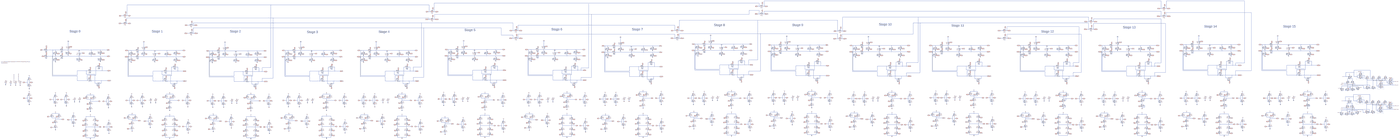
[diagram p0: schematic 16_bit carry_skip_adder.asc, whole sheet]
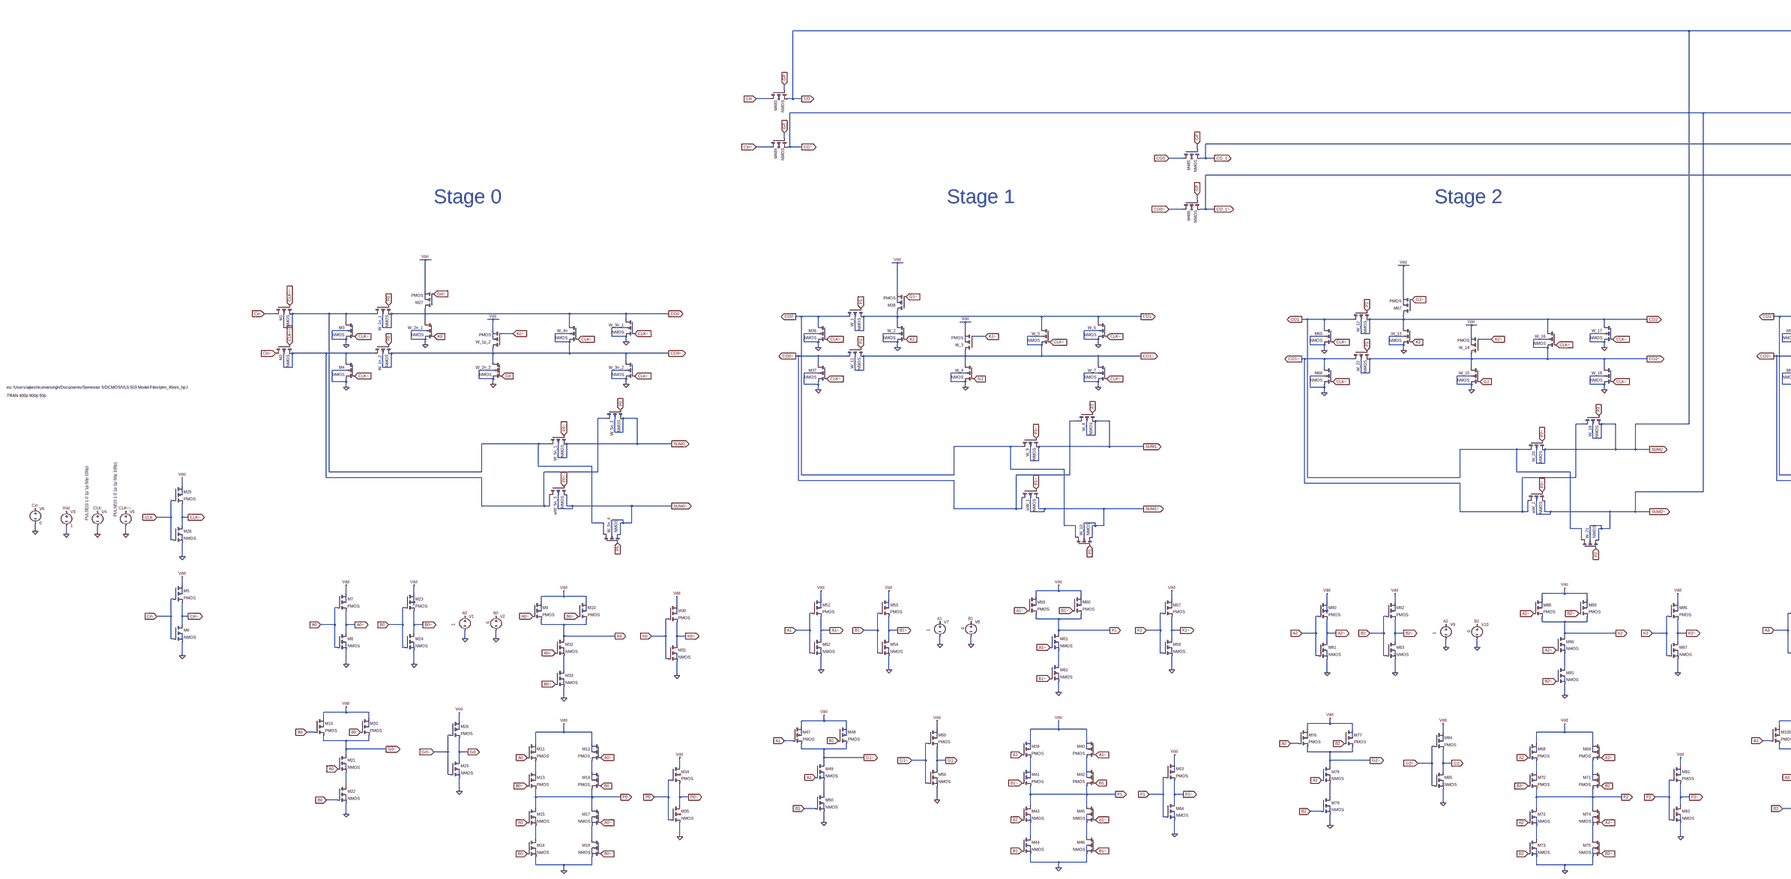
[diagram p1: schematic 16_bit carry_skip_adder.asc, part, row 1 of 1, column 1 of 5]
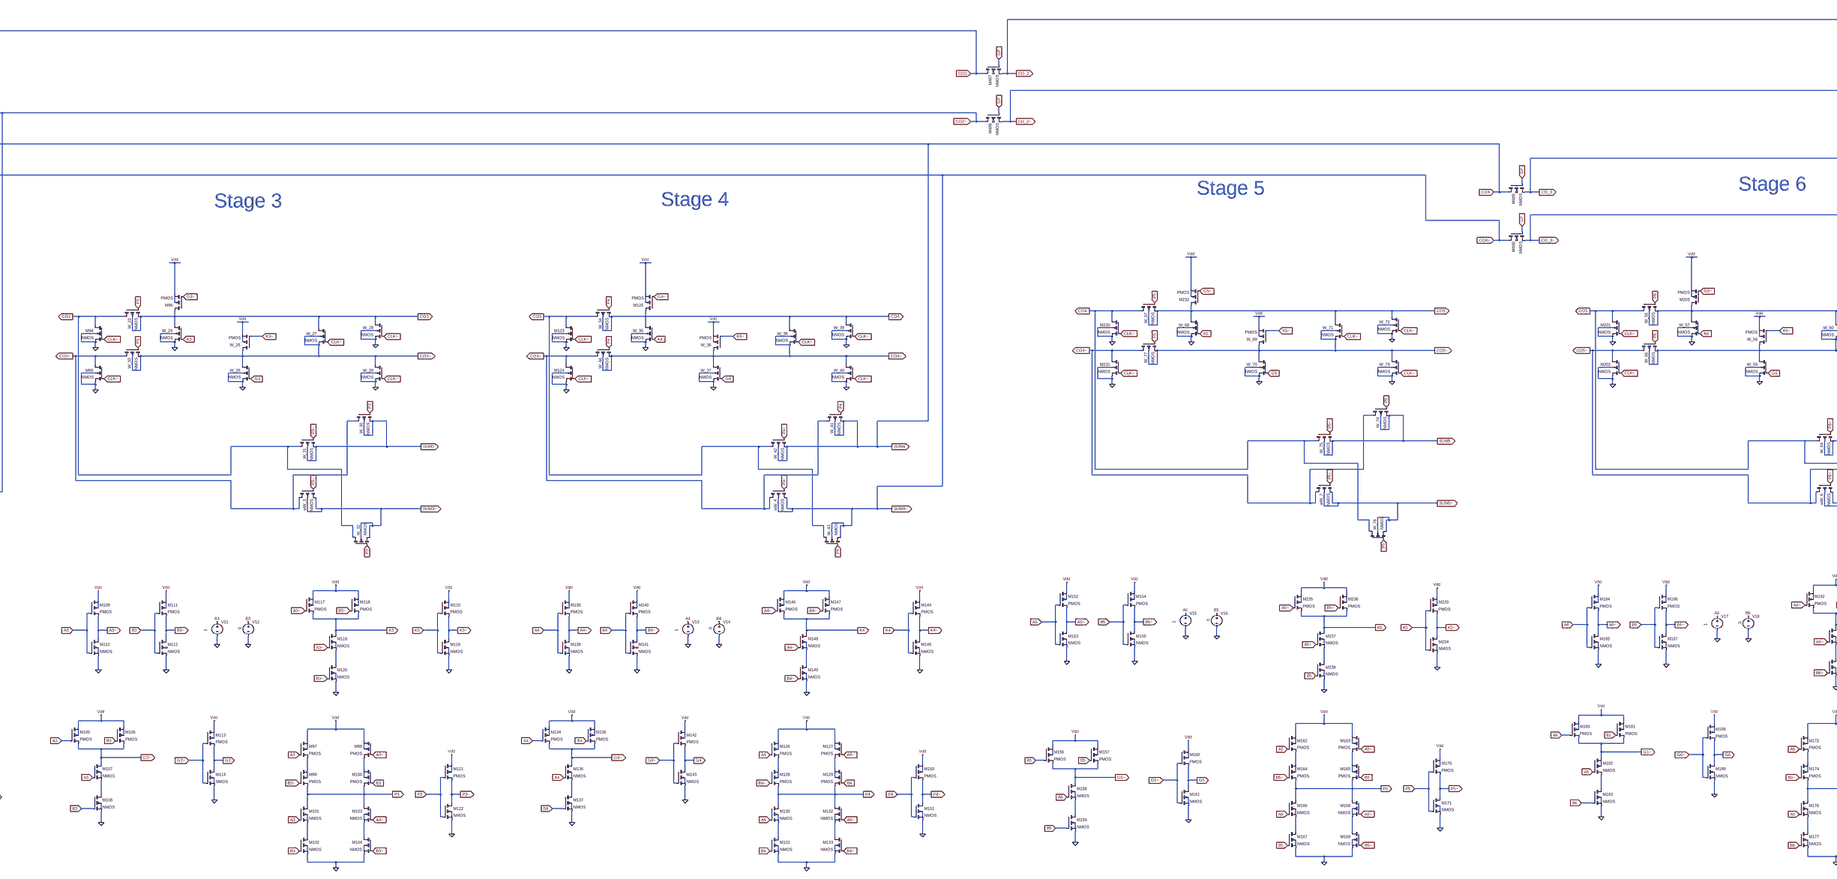
[diagram p2: schematic 16_bit carry_skip_adder.asc, part, row 1 of 1, column 2 of 5]
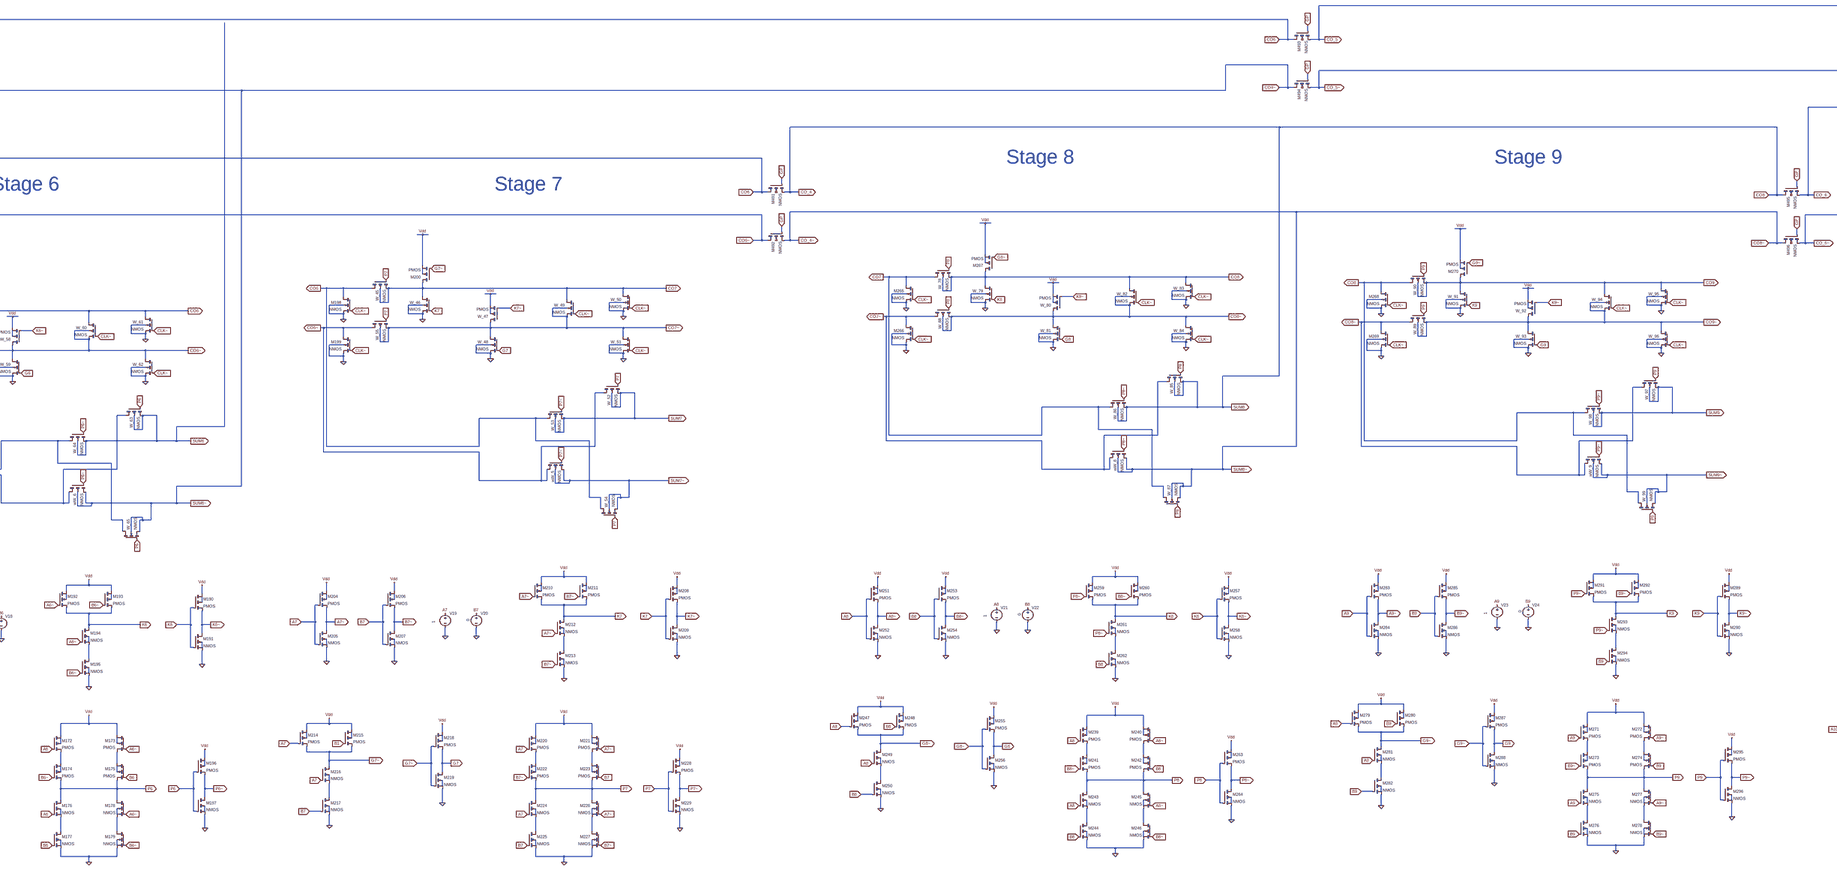
[diagram p3: schematic 16_bit carry_skip_adder.asc, part, row 1 of 1, column 3 of 5]
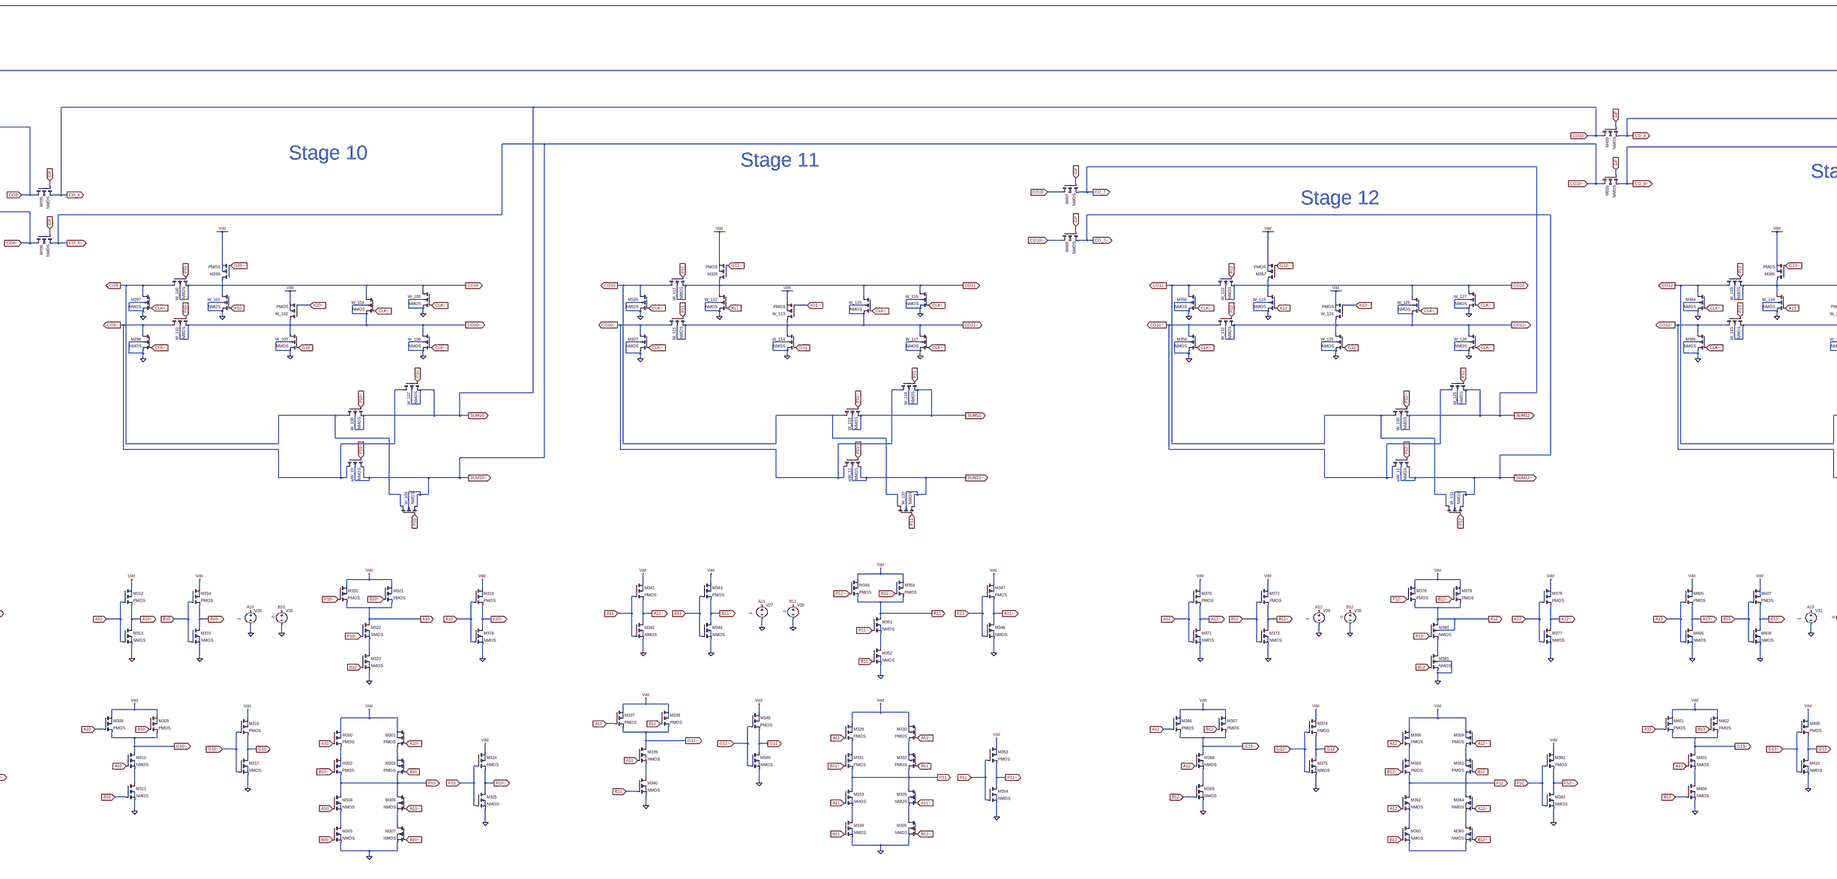
[diagram p4: schematic 16_bit carry_skip_adder.asc, part, row 1 of 1, column 4 of 5]
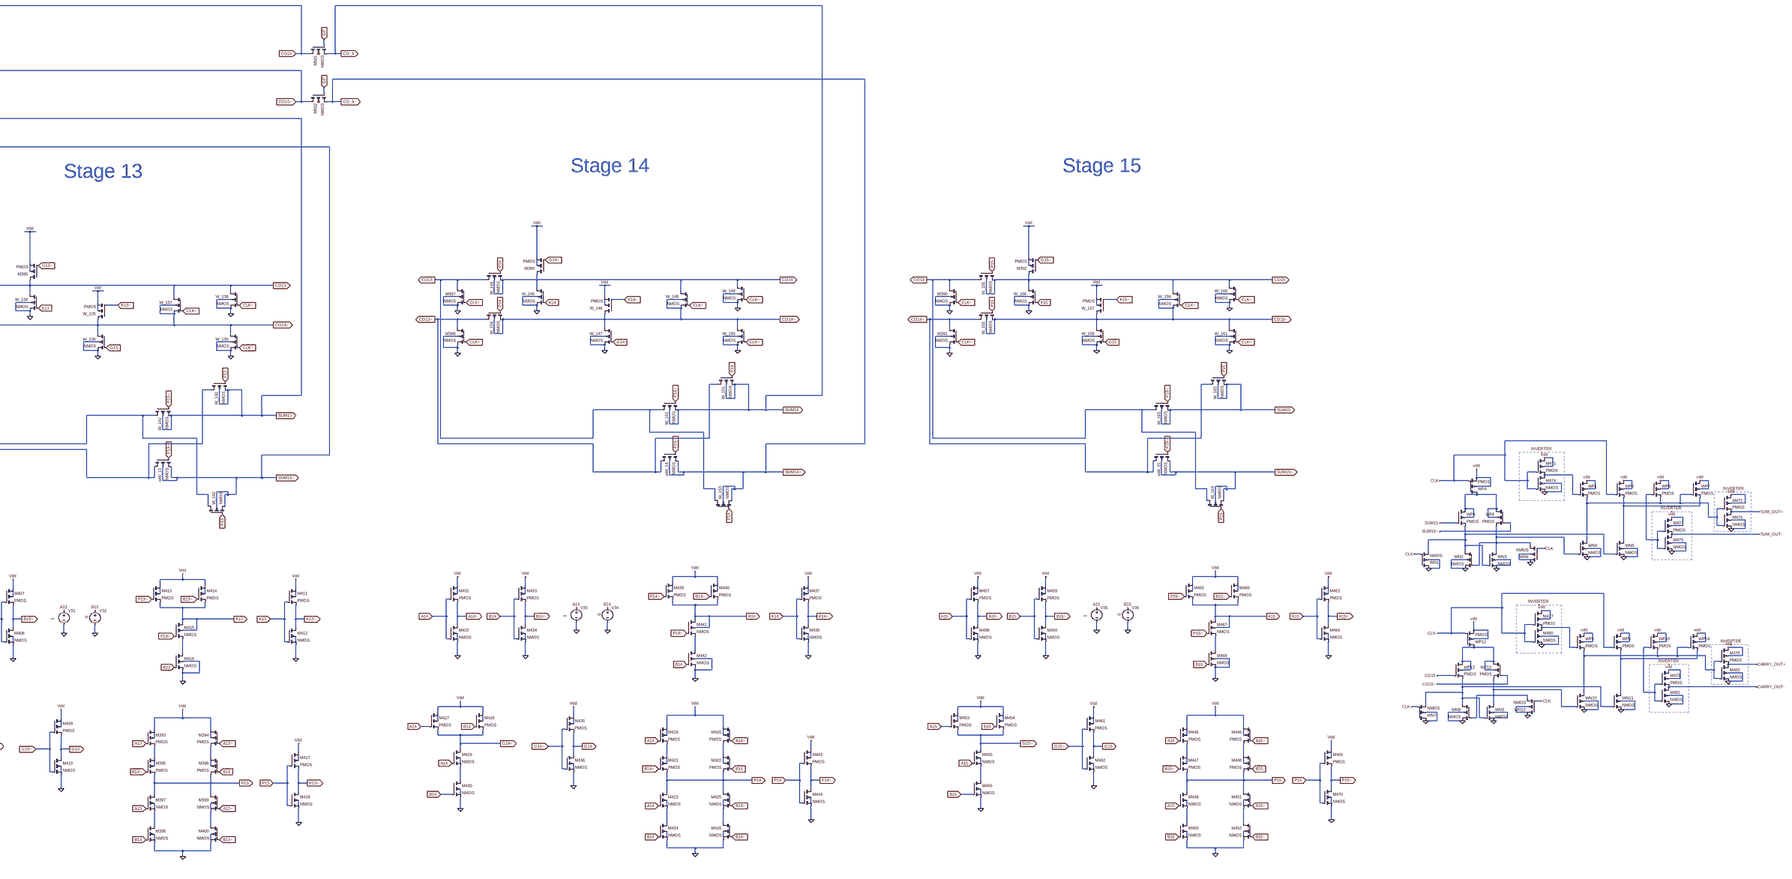
[diagram p5: schematic 16_bit carry_skip_adder.asc, part, row 1 of 1, column 5 of 5]
* 16_bit carry_skip_adder.asc
M§W_1n_1 N025 P0 CO0 CO0 NMOS l=45nm w=90nm
M§W_2n_1 CO0 K0 0 0 NMOS l=45nm w=180nm
M§W_1p_2 CO0~ K0~ Vdd N029 PMOS l=45nm w=180nm
M§W_2n_2 CO0~ G0 0 0 NMOS l=45nm w=180n
M§W_4n CO0 CLK~ CO0~ CO0~ NMOS l=45nm w=360nm
M§W_3n_1 CO0 CLK~ 0 0 NMOS l=45nm w=270nm
M§W_3n_2 CO0~ CLK~ 0 0 NMOS l=45nm w=270nm
M§W_5n_2 N034 P0 SUM0 SUM0 NMOS l=45nm w=450nm
M§W_5n_1 N025 P0~ SUM0 SUM0 NMOS l=45nm w=450nm
M§wW_5n_3 N034 P0~ SUM0~ SUM0~ NMOS l=45nm w=450nm
M§W_5n_4 N025 P0 SUM0~ SUM0~ NMOS l=45nm w=450nm
M3 N025 CLK~ 0 0 NMOS l=45nm w=90nm
M4 N034 CLK~ 0 0 NMOS l=45nm w=90nm
M2 Cin~ CLK~~ N034 N034 NMOS l=45nm w=90nm
M1 Cin CLK~~ N025 N025 NMOS l=45nm w=90nm
V1 A0 0 1
V2 B0 0 0
V3 Vdd 0 1
M11 Vdd A0 N369 N292 PMOS l=45n w=180n
M12 Vdd A0~ N370 N293 PMOS l=45n w=180n
M13 N369 B0~ P0 N399 PMOS l=45n w=180n
M14 N370 B0 P0 N400 PMOS l=45n w=180n
M15 P0 A0 N527 N488 NMOS l=45n w=90n
M16 N527 B0 0 N550 NMOS l=45n w=90n
M17 P0 A0~ N528 N489 NMOS l=45n w=90n
M18 N528 B0~ 0 N551 NMOS l=45n w=90n
M19 Vdd A0 G0~ N240 PMOS l=45nm w=90nm
M20 Vdd B0 G0~ N241 PMOS l=45nm w=90nm
M21 G0~ A0 N414 N359 NMOS l=45nm w=90nm
M22 N414 B0 0 N432 NMOS l=45nm w=90nm
M§W_1n_2 N034 P0 CO0~ CO0~ NMOS l=45nm w=90nm
V4 CLK 0 PULSE(0 1 0 1p 1p 50p 100p)
M25 Vdd CLK CLK~ N036 PMOS l=45nm w=180nm
M26 CLK~ CLK 0 N043 NMOS l=45nm w=90nm
V5 CLK~~ 0 PULSE(0 1 0 1p 1p 50p 100p)
V6 Cin 0 0
M5 Vdd Cin Cin~ N062 PMOS l=45nm w=180nm
M6 Cin~ Cin 0 N137 NMOS l=45nm w=90nm
M7 Vdd A0 A0~ N094 PMOS l=45nm w=180n
M8 A0~ A0 0 N163 NMOS l=45n w=90n
M23 Vdd B0 B0~ N095 PMOS l=45nm w=180n
M24 B0~ B0 0 N164 NMOS l=45n w=90n
M27 CO0 G0~ Vdd N012 PMOS l=45nm w=180nm
M28 Vdd G0~ G0 N245 PMOS l=45nm w=180n
M29 G0 G0~ 0 N385 NMOS l=45n w=90n
M30 Vdd K0 K0~ N124 PMOS l=45nm w=180n
M31 K0~ K0 0 N196 NMOS l=45n w=90n
M9 Vdd A0~ K0 N119 PMOS l=45nm w=90nm
M10 Vdd B0~ K0 N120 PMOS l=45nm w=90nm
M32 K0 A0~ N209 N182 NMOS l=45nm w=90nm
M33 N209 B0~ 0 N216 NMOS l=45nm w=90nm
M34 Vdd P0 P0~ NC_01 PMOS l=45nm w=180n
M35 P0~ P0 0 NC_02 NMOS l=45n w=90n
M§W_1 CO0 P1 CO1 CO1 NMOS l=45nm w=90nm
M§W_2 CO1 K1 0 0 NMOS l=45nm w=180nm
M§W_3 CO1~ K1~ Vdd N030 PMOS l=45nm w=180nm
M§W_4 CO1~ G1 0 0 NMOS l=45nm w=180n
M§W_5 CO1 CLK~ CO1~ CO1~ NMOS l=45nm w=360nm
M§W_6 CO1 CLK~ 0 0 NMOS l=45nm w=270nm
M§W_7 CO1~ CLK~ 0 0 NMOS l=45nm w=270nm
M§W_8 CO0~ P1 SUM1 SUM1 NMOS l=45nm w=450nm
M§W_9 CO0 P1~ SUM1 SUM1 NMOS l=45nm w=450nm
M§wW_1 CO0~ P1~ SUM1~ SUM1~ NMOS l=45nm w=450nm
M§W_10 CO0 P1 SUM1~ SUM1~ NMOS l=45nm w=450nm
M36 CO0 CLK~ 0 0 NMOS l=45nm w=90nm
M37 CO0~ CLK~ 0 0 NMOS l=45nm w=90nm
M§W_11 CO0~ P1 CO1~ CO1~ NMOS l=45nm w=90nm
M38 CO1 G1~ Vdd N013 PMOS l=45nm w=180nm
V7 A1 0 1
V8 B1 0 0
M39 Vdd A1 N360 N286 PMOS l=45n w=180n
M40 Vdd A1~ N361 N287 PMOS l=45n w=180n
M41 N360 B1~ P1 N388 PMOS l=45n w=180n
M42 N361 B1 P1 N389 PMOS l=45n w=180n
M43 P1 A1 N515 N477 NMOS l=45n w=90n
M44 N515 B1 0 N543 NMOS l=45n w=90n
M45 P1 A1~ N516 N478 NMOS l=45n w=90n
M46 N516 B1~ 0 N544 NMOS l=45n w=90n
M47 Vdd A1 G1~ N253 PMOS l=45nm w=90nm
M48 Vdd B1 G1~ N254 PMOS l=45nm w=90nm
M49 G1~ A1 N420 N387 NMOS l=45nm w=90nm
M50 N420 B1 0 N453 NMOS l=45nm w=90nm
M51 Vdd A1 A1~ N108 PMOS l=45nm w=180n
M52 A1~ A1 0 N183 NMOS l=45n w=90n
M53 Vdd B1 B1~ N109 PMOS l=45nm w=180n
M54 B1~ B1 0 N184 NMOS l=45n w=90n
M55 Vdd G1~ G1 N265 PMOS l=45nm w=180n
M56 G1 G1~ 0 N408 NMOS l=45n w=90n
M57 Vdd K1 K1~ N110 PMOS l=45nm w=180n
M58 K1~ K1 0 N185 NMOS l=45n w=90n
M59 Vdd A1~ K1 N101 PMOS l=45nm w=90nm
M60 Vdd B1~ K1 N102 PMOS l=45nm w=90nm
M61 K1 A1~ N202 N165 NMOS l=45nm w=90nm
M62 N202 B1~ 0 N212 NMOS l=45nm w=90nm
M63 Vdd P1 P1~ N371 PMOS l=45nm w=180n
M64 P1~ P1 0 N474 NMOS l=45n w=90n
M§W_12 CO1 P2 CO CO NMOS l=45nm w=90nm
M§W_13 CO K2 0 0 NMOS l=45nm w=180nm
M§W_14 CO~ K2~ Vdd N033 PMOS l=45nm w=180nm
M§W_15 CO~ G2 0 0 NMOS l=45nm w=180n
M§W_16 CO CLK~ CO~ CO~ NMOS l=45nm w=360nm
M§W_17 CO CLK~ 0 0 NMOS l=45nm w=270nm
M§W_18 CO~ CLK~ 0 0 NMOS l=45nm w=270nm
M§W_19 CO1~ P2 CO CO NMOS l=45nm w=450nm
M§W_20 CO1 P2~ CO CO NMOS l=45nm w=450nm
M§wW_2 CO1~ P2~ CO~ CO~ NMOS l=45nm w=450nm
M§W_21 CO1 P2 CO~ CO~ NMOS l=45nm w=450nm
M65 CO1 CLK~ 0 0 NMOS l=45nm w=90nm
M66 CO1~ CLK~ 0 0 NMOS l=45nm w=90nm
M§W_22 CO1~ P2 CO~ CO~ NMOS l=45nm w=90nm
M67 CO G2~ Vdd N017 PMOS l=45nm w=180nm
V9 A2 0 1
V10 B2 0 0
M68 Vdd A2 N372 N294 PMOS l=45n w=180n
M69 Vdd A2~ N373 N295 PMOS l=45n w=180n
M70 N372 B2~ P2 N402 PMOS l=45n w=180n
M71 N373 B2 P2 N403 PMOS l=45n w=180n
M72 P2 A2 N529 N490 NMOS l=45n w=90n
M73 N529 B2 0 N552 NMOS l=45n w=90n
M74 P2 A2~ N530 N491 NMOS l=45n w=90n
M75 N530 B2~ 0 N553 NMOS l=45n w=90n
M76 Vdd A2 G2~ N266 PMOS l=45nm w=90nm
M77 Vdd B2 G2~ N267 PMOS l=45nm w=90nm
M78 G2~ A2 N426 N401 NMOS l=45nm w=90nm
M79 N426 B2 0 N462 NMOS l=45nm w=90nm
M80 Vdd A2 A2~ N121 PMOS l=45nm w=180n
M81 A2~ A2 0 N193 NMOS l=45n w=90n
M82 Vdd B2 B2~ N122 PMOS l=45nm w=180n
M83 B2~ B2 0 N194 NMOS l=45n w=90n
M84 Vdd G2~ G2 N278 PMOS l=45nm w=180n
M85 G2 G2~ 0 N415 NMOS l=45n w=90n
M86 Vdd K2 K2~ N123 PMOS l=45nm w=180n
M87 K2~ K2 0 N195 NMOS l=45n w=90n
M88 Vdd A2~ K2 N111 PMOS l=45nm w=90nm
M89 Vdd B2~ K2 N112 PMOS l=45nm w=90nm
M90 K2 A2~ N207 N176 NMOS l=45nm w=90nm
M91 N207 B2~ 0 N215 NMOS l=45nm w=90nm
M92 Vdd P2 P2~ N386 PMOS l=45nm w=180n
M93 P2~ P2 0 N479 NMOS l=45n w=90n
M§W_23 CO P3 CO3 CO3 NMOS l=45nm w=90nm
M§W_24 CO3 K3 0 0 NMOS l=45nm w=180nm
M§W_25 CO3~ K3~ Vdd N031 PMOS l=45nm w=180nm
M§W_26 CO3~ G3 0 0 NMOS l=45nm w=180n
M§W_27 CO3 CLK~ CO3~ CO3~ NMOS l=45nm w=360nm
M§W_28 CO3 CLK~ 0 0 NMOS l=45nm w=270nm
M§W_29 CO3~ CLK~ 0 0 NMOS l=45nm w=270nm
M§W_30 CO~ P3 SUM3 SUM3 NMOS l=45nm w=450nm
M§W_31 CO P3~ SUM3 SUM3 NMOS l=45nm w=450nm
M§wW_3 CO~ P3~ SUM3~ SUM3~ NMOS l=45nm w=450nm
M§W_32 CO P3 SUM3~ SUM3~ NMOS l=45nm w=450nm
M94 CO CLK~ 0 0 NMOS l=45nm w=90nm
M95 CO~ CLK~ 0 0 NMOS l=45nm w=90nm
M§W_33 CO~ P3 CO3~ CO3~ NMOS l=45nm w=90nm
M96 CO3 G3~ Vdd N014 PMOS l=45nm w=180nm
V11 A3 0 1
V12 B3 0 0
M97 Vdd A3 N362 N288 PMOS l=45n w=180n
M98 Vdd A3~ N363 N289 PMOS l=45n w=180n
M99 N362 B3~ P3 N391 PMOS l=45n w=180n
M100 N363 B3 P3 N392 PMOS l=45n w=180n
M101 P3 A3 N517 N480 NMOS l=45n w=90n
M102 N517 B3 0 N545 NMOS l=45n w=90n
M103 P3 A3~ N518 N481 NMOS l=45n w=90n
M104 N518 B3~ 0 N546 NMOS l=45n w=90n
M105 Vdd A3 G3~ N255 PMOS l=45nm w=90nm
M106 Vdd B3 G3~ N256 PMOS l=45nm w=90nm
M107 G3~ A3 N421 N390 NMOS l=45nm w=90nm
M108 N421 B3 0 N454 NMOS l=45nm w=90nm
M109 Vdd A3 A3~ N113 PMOS l=45nm w=180n
M110 A3~ A3 0 N186 NMOS l=45n w=90n
M111 Vdd B3 B3~ N114 PMOS l=45nm w=180n
M112 B3~ B3 0 NC_03 NMOS l=45n w=90n
M113 Vdd G3~ G3 N268 PMOS l=45nm w=180n
M114 G3 G3~ 0 N409 NMOS l=45n w=90n
M115 Vdd K3 K3~ N115 PMOS l=45nm w=180n
M116 K3~ K3 0 N187 NMOS l=45n w=90n
M117 Vdd A3~ K3 N103 PMOS l=45nm w=90nm
M118 Vdd B3~ K3 N104 PMOS l=45nm w=90nm
M119 K3 A3~ N203 N166 NMOS l=45nm w=90nm
M120 N203 B3~ 0 N213 NMOS l=45nm w=90nm
M121 Vdd P3 P3~ N374 PMOS l=45nm w=180n
M122 P3~ P3 0 N475 NMOS l=45n w=90n
M§W_34 CO3 P4 CO_1 CO_1 NMOS l=45nm w=90nm
M§W_35 CO_1 K4 0 0 NMOS l=45nm w=180nm
M§W_36 CO_2~ K4~ Vdd N032 PMOS l=45nm w=180nm
M§W_37 CO_2~ G4 0 0 NMOS l=45nm w=180n
M§W_38 CO_1 CLK~ CO_2~ CO_2~ NMOS l=45nm w=360nm
M§W_39 CO_1 CLK~ 0 0 NMOS l=45nm w=270nm
M§W_40 CO_2~ CLK~ 0 0 NMOS l=45nm w=270nm
M§W_41 CO3~ P4 CO_1 CO_1 NMOS l=45nm w=450nm
M§W_42 CO3 P4~ CO_1 CO_1 NMOS l=45nm w=450nm
M§wW_4 CO3~ P4~ CO_2~ CO_2~ NMOS l=45nm w=450nm
M§W_43 CO3 P4 CO_2~ CO_2~ NMOS l=45nm w=450nm
M123 CO3 CLK~ 0 0 NMOS l=45nm w=90nm
M124 CO3~ CLK~ 0 0 NMOS l=45nm w=90nm
M§W_44 CO3~ P4 CO_2~ CO_2~ NMOS l=45nm w=90nm
M125 CO_1 G4~ Vdd N015 PMOS l=45nm w=180nm
V13 A4 0 1
V14 B4 0 0
M126 Vdd A4 N364 N290 PMOS l=45n w=180n
M127 Vdd A4~ N365 N291 PMOS l=45n w=180n
M128 N364 B4~ P4 N394 PMOS l=45n w=180n
M129 N365 B4 P4 N395 PMOS l=45n w=180n
M130 P4 A4 N519 N482 NMOS l=45n w=90n
M131 N519 B4 0 N547 NMOS l=45n w=90n
M132 P4 A4~ N520 N483 NMOS l=45n w=90n
M133 N520 B4~ 0 N548 NMOS l=45n w=90n
M134 Vdd A4 G4~ N257 PMOS l=45nm w=90nm
M135 Vdd B4 G4~ N258 PMOS l=45nm w=90nm
M136 G4~ A4 N422 N393 NMOS l=45nm w=90nm
M137 N422 B4 0 N455 NMOS l=45nm w=90nm
M138 Vdd A4 A4~ N116 PMOS l=45nm w=180n
M139 A4~ A4 0 N188 NMOS l=45n w=90n
M140 Vdd B4 B4~ N117 PMOS l=45nm w=180n
M141 B4~ B4 0 NC_04 NMOS l=45n w=90n
M142 Vdd G4~ G4 N269 PMOS l=45nm w=180n
M143 G4 G4~ 0 N410 NMOS l=45n w=90n
M144 Vdd K4 K4~ N118 PMOS l=45nm w=180n
M145 K4~ K4 0 N189 NMOS l=45n w=90n
M146 Vdd A4~ K4 N105 PMOS l=45nm w=90nm
M147 Vdd B4~ K4 N106 PMOS l=45nm w=90nm
M148 K4 A4~ N204 N167 NMOS l=45nm w=90nm
M149 N204 B4~ 0 N214 NMOS l=45nm w=90nm
M150 Vdd P4 P4~ N375 PMOS l=45nm w=180n
M151 P4~ P4 0 N476 NMOS l=45n w=90n
V15 A5 0 1
V16 B5 0 0
M152 Vdd A5 A5~ N088 PMOS l=45nm w=180n
M153 A5~ A5 0 N158 NMOS l=45n w=90n
M154 Vdd B5 B5~ N089 PMOS l=45nm w=180n
M155 B5~ B5 0 N159 NMOS l=45n w=90n
M156 Vdd A5 G5~ N300 PMOS l=45nm w=90nm
M157 Vdd B5 G5~ N301 PMOS l=45nm w=90nm
M158 G5~ A5 N467 N427 NMOS l=45nm w=90nm
M159 N467 B5 0 N504 NMOS l=45nm w=90nm
M160 Vdd G5~ G5 N310 PMOS l=45nm w=180n
M161 G5 G5~ 0 N435 NMOS l=45n w=90n
M162 Vdd A5 N329 N280 PMOS l=45n w=180n
M163 Vdd A5~ N330 N281 PMOS l=45n w=180n
M164 N329 B5~ P5 N376 PMOS l=45n w=180n
M165 N330 B5 P5 N377 PMOS l=45n w=180n
M166 P5 A5 N505 N468 NMOS l=45n w=90n
M167 N505 B5 0 N537 NMOS l=45n w=90n
M168 P5 A5~ N506 N469 NMOS l=45n w=90n
M169 N506 B5~ 0 N538 NMOS l=45n w=90n
M170 Vdd P5 P5~ N344 PMOS l=45nm w=180n
M171 P5~ P5 0 N463 NMOS l=45n w=90n
V17 A6 0 1
V18 B6 0 0
M172 Vdd A6 N331 N282 PMOS l=45n w=180n
M173 Vdd A6~ N332 N283 PMOS l=45n w=180n
M174 N331 B6~ P6 N378 PMOS l=45n w=180n
M175 N332 B6 P6 N379 PMOS l=45n w=180n
M176 P6 A6 N507 N470 NMOS l=45n w=90n
M177 N507 B6 0 N539 NMOS l=45n w=90n
M178 P6 A6~ N508 N471 NMOS l=45n w=90n
M179 N508 B6~ 0 N540 NMOS l=45n w=90n
M180 Vdd A6 G1~ N246 PMOS l=45nm w=90nm
M181 Vdd B1 G1~ N247 PMOS l=45nm w=90nm
M182 G1~ A6 N417 N345 NMOS l=45nm w=90nm
M183 N417 B6 0 N436 NMOS l=45nm w=90nm
M184 Vdd A6 A6~ N098 PMOS l=45nm w=180n
M185 A6~ A6 0 N168 NMOS l=45n w=90n
M186 Vdd B6 B6~ N099 PMOS l=45nm w=180n
M187 B6~ B6 0 N169 NMOS l=45n w=90n
M188 Vdd G6~ G6 N248 PMOS l=45nm w=180n
M189 G6 G6~ 0 N396 NMOS l=45n w=90n
M190 Vdd K6 K6~ N100 PMOS l=45nm w=180n
M191 K6~ K6 0 N170 NMOS l=45n w=90n
M192 Vdd A6~ K6 N090 PMOS l=45nm w=90nm
M193 Vdd B6~ K6 N091 PMOS l=45nm w=90nm
M194 K6 A6~ N197 N148 NMOS l=45nm w=90nm
M195 N197 B6~ 0 N210 NMOS l=45nm w=90nm
M196 Vdd P6 P6~ N346 PMOS l=45nm w=180n
M197 P6~ P6 0 N464 NMOS l=45n w=90n
M§W_45 CO_3 P7 CO7 CO7 NMOS l=45nm w=90nm
M§W_46 CO7 K7 0 0 NMOS l=45nm w=180nm
M§W_47 CO7~ K7~ Vdd N026 PMOS l=45nm w=180nm
M§W_48 CO7~ G7 0 0 NMOS l=45nm w=180n
M§W_49 CO7 CLK~ CO7~ CO7~ NMOS l=45nm w=360nm
M§W_50 CO7 CLK~ 0 0 NMOS l=45nm w=270nm
M§W_51 CO7~ CLK~ 0 0 NMOS l=45nm w=270nm
M§W_52 CO_3~ P7 SUM7 SUM7 NMOS l=45nm w=450nm
M§W_53 CO_3 P7~ SUM7 SUM7 NMOS l=45nm w=450nm
M§wW_5 CO_3~ P7~ SUM7~ SUM7~ NMOS l=45nm w=450nm
M§W_54 CO_3 P7 SUM7~ SUM7~ NMOS l=45nm w=450nm
M198 CO_3 CLK~ 0 0 NMOS l=45nm w=90nm
M199 CO_3~ CLK~ 0 0 NMOS l=45nm w=90nm
M§W_55 CO_3~ P7 CO7~ CO7~ NMOS l=45nm w=90nm
M200 CO7 G7~ Vdd N009 PMOS l=45nm w=180nm
M§W_56 CO5 P6 CO_3 CO_3 NMOS l=45nm w=90nm
M§W_57 CO_3 K6 0 0 NMOS l=45nm w=180nm
M§W_58 CO_3~ K6~ Vdd N028 PMOS l=45nm w=180nm
M§W_59 CO_3~ G6 0 0 NMOS l=45nm w=180n
M§W_60 CO_3 CLK~ CO_3~ CO_3~ NMOS l=45nm w=360nm
M§W_61 CO_3 CLK~ 0 0 NMOS l=45nm w=270nm
M§W_62 CO_3~ CLK~ 0 0 NMOS l=45nm w=270nm
M§W_63 CO5~ P6 SUM6 SUM6 NMOS l=45nm w=450nm
M§W_64 CO5 P6~ SUM6 SUM6 NMOS l=45nm w=450nm
M§wW_6 CO5~ P6~ CO_2~ CO_2~ NMOS l=45nm w=450nm
M§W_65 CO5 P6 CO_2~ CO_2~ NMOS l=45nm w=450nm
M201 CO5 CLK~ 0 0 NMOS l=45nm w=90nm
M202 CO5~ CLK~ 0 0 NMOS l=45nm w=90nm
M§W_66 CO5~ P6 CO_3~ CO_3~ NMOS l=45nm w=90nm
M203 CO_3 G6~ Vdd N011 PMOS l=45nm w=180nm
V19 A7 0 1
V20 B7 0 0
M204 Vdd A7 A7~ N092 PMOS l=45nm w=180n
M205 A7~ A7 0 N161 NMOS l=45n w=90n
M206 Vdd B7 B7~ N093 PMOS l=45nm w=180n
M207 B7~ B7 0 N162 NMOS l=45n w=90n
M208 Vdd K7 K7~ N063 PMOS l=45nm w=180n
M209 K7~ K7 0 N138 NMOS l=45n w=90n
M210 Vdd A7~ K7 N048 PMOS l=45nm w=90nm
M211 Vdd B7~ K7 N049 PMOS l=45nm w=90nm
M212 K7 A7~ N178 N128 NMOS l=45nm w=90nm
M213 N178 B7~ 0 N205 NMOS l=45nm w=90nm
M214 Vdd A7 G7~ N270 PMOS l=45nm w=90nm
M215 Vdd B1 G7~ N271 PMOS l=45nm w=90nm
M216 G7~ A7 N428 N404 NMOS l=45nm w=90nm
M217 N428 B7 0 N465 NMOS l=45nm w=90nm
M218 Vdd G7~ G7 N279 PMOS l=45nm w=180n
M219 G7 G7~ 0 N416 NMOS l=45n w=90n
M220 Vdd A7 N333 N284 PMOS l=45n w=180n
M221 Vdd A7~ N334 N285 PMOS l=45n w=180n
M222 N333 B7~ P7 N380 PMOS l=45n w=180n
M223 N334 B7 P7 N381 PMOS l=45n w=180n
M224 P7 A7 N509 N472 NMOS l=45n w=90n
M225 N509 B7 0 N541 NMOS l=45n w=90n
M226 P7 A7~ N510 N473 NMOS l=45n w=90n
M227 N510 B7~ 0 N542 NMOS l=45n w=90n
M228 Vdd P7 P7~ N347 PMOS l=45nm w=180n
M229 P7~ P7 0 N466 NMOS l=45n w=90n
M§W_67 CO_1 P5 CO5 CO5 NMOS l=45nm w=90nm
M§W_68 CO5 K5 0 0 NMOS l=45nm w=180nm
M§W_69 CO5~ K5~ Vdd N027 PMOS l=45nm w=180nm
M§W_70 CO5~ G5 0 0 NMOS l=45nm w=180n
M§W_71 CO5 CLK~ CO5~ CO5~ NMOS l=45nm w=360nm
M§W_72 CO5 CLK~ 0 0 NMOS l=45nm w=270nm
M§W_73 CO5~ CLK~ 0 0 NMOS l=45nm w=270nm
M§W_74 CO_2~ P5 SUM5 SUM5 NMOS l=45nm w=450nm
M§W_75 CO_1 P5~ SUM5 SUM5 NMOS l=45nm w=450nm
M§wW_7 CO_2~ P5~ SUM5~ SUM5~ NMOS l=45nm w=450nm
M§W_76 CO_1 P5 SUM5~ SUM5~ NMOS l=45nm w=450nm
M230 CO_1 CLK~ 0 0 NMOS l=45nm w=90nm
M231 CO_2~ CLK~ 0 0 NMOS l=45nm w=90nm
M§W_77 CO_2~ P5 CO5~ CO5~ NMOS l=45nm w=90nm
M232 CO5 G5~ Vdd N010 PMOS l=45nm w=180nm
M233 Vdd K5 K5~ N107 PMOS l=45nm w=180n
M234 K5~ K5 0 N177 NMOS l=45n w=90n
M235 Vdd A5~ K5 N096 PMOS l=45nm w=90nm
M236 Vdd B5~ K5 N097 PMOS l=45nm w=90nm
M237 K5 A5~ N199 N160 NMOS l=45nm w=90nm
M238 N199 B5 0 N211 NMOS l=45nm w=90nm
V21 A8 0 1
V22 B8 0 0
M239 Vdd A8 N302 N259 PMOS l=45n w=180n
M240 Vdd A8~ N303 N260 PMOS l=45n w=180n
M241 N302 B8~ P8 N336 PMOS l=45n w=180n
M242 N303 B8 P8 N337 PMOS l=45n w=180n
M243 P8 A8 N492 N444 NMOS l=45n w=90n
M244 N492 B8 0 N521 NMOS l=45n w=90n
M245 P8 A8~ N493 N445 NMOS l=45n w=90n
M246 N493 B8~ 0 N522 NMOS l=45n w=90n
M247 Vdd A8 G8~ N223 PMOS l=45nm w=90nm
M248 Vdd B8 G8~ N224 PMOS l=45nm w=90nm
M249 G8~ A8 N405 N335 NMOS l=45nm w=90nm
M250 N405 B8 0 N423 NMOS l=45nm w=90nm
M251 Vdd A8 A8~ N064 PMOS l=45nm w=180n
M252 A8~ A8 0 N139 NMOS l=45n w=90n
M253 Vdd B8 B8~ N065 PMOS l=45nm w=180n
M254 B8~ B8 0 N140 NMOS l=45n w=90n
M255 Vdd G8~ G8 N231 PMOS l=45nm w=180n
M256 G8 G8~ 0 N366 NMOS l=45n w=90n
M257 Vdd K8 K8~ N066 PMOS l=45nm w=180n
M258 K8~ K8 0 N141 NMOS l=45n w=90n
M259 Vdd P8~ K8 N050 PMOS l=45nm w=90nm
M260 Vdd B8~ K8 N051 PMOS l=45nm w=90nm
M261 K8 P8~ N179 N129 NMOS l=45nm w=90nm
M262 N179 B8 0 N206 NMOS l=45nm w=90nm
M263 Vdd P8 P8~ N311 PMOS l=45nm w=180n
M264 P8~ P8 0 N437 NMOS l=45n w=90n
M§W_78 CO7 P8 CO_4 CO_4 NMOS l=45nm w=90nm
M§W_79 CO_4 K8 0 0 NMOS l=45nm w=180nm
M§W_80 CO_4~ K8~ Vdd N016 PMOS l=45nm w=180nm
M§W_81 CO_4~ G8 0 0 NMOS l=45nm w=180n
M§W_82 CO_4 CLK~ CO_4~ CO_4~ NMOS l=45nm w=360nm
M§W_83 CO_4 CLK~ 0 0 NMOS l=45nm w=270nm
M§W_84 CO_4~ CLK~ 0 0 NMOS l=45nm w=270nm
M§W_85 CO7~ P8 CO_4 CO_4 NMOS l=45nm w=450nm
M§W_86 CO7 P8~ CO_4 CO_4 NMOS l=45nm w=450nm
M§wW_8 CO7~ P8~ CO_4~ CO_4~ NMOS l=45nm w=450nm
M§W_87 CO7 P8 CO_4~ CO_4~ NMOS l=45nm w=450nm
M265 CO7 CLK~ 0 0 NMOS l=45nm w=90nm
M266 CO7~ CLK~ 0 0 NMOS l=45nm w=90nm
M§W_88 CO7~ P8 CO_4~ CO_4~ NMOS l=45nm w=90nm
M267 CO_4 G8~ Vdd N001 PMOS l=45nm w=180nm
M§wW_9 CO_4~ P9~ SUM9~ SUM9~ NMOS l=45nm w=450nm
M§W_89 CO_4~ P9 CO9~ CO9~ NMOS l=45nm w=90nm
M§W_90 CO_4 P9 CO9 CO9 NMOS l=45nm w=90nm
M§W_91 CO9 K9 0 0 NMOS l=45nm w=180nm
M§W_92 CO9~ K9~ Vdd N020 PMOS l=45nm w=180nm
M§W_93 CO9~ G9 0 0 NMOS l=45nm w=180n
M§W_94 CO9 CLK~ CO9~ CO9~ NMOS l=45nm w=360nm
M§W_95 CO9 CLK~ 0 0 NMOS l=45nm w=270nm
M§W_96 CO9~ CLK~ 0 0 NMOS l=45nm w=270nm
M§W_97 CO_4~ P9 SUM9 SUM9 NMOS l=45nm w=450nm
M§W_98 CO_4 P9~ SUM9 SUM9 NMOS l=45nm w=450nm
M§W_99 CO_4 P9 SUM9~ SUM9~ NMOS l=45nm w=450nm
M268 CO_4 CLK~ 0 0 NMOS l=45nm w=90nm
M269 CO_4~ CLK~ 0 0 NMOS l=45nm w=90nm
M270 CO9 G9~ Vdd N004 PMOS l=45nm w=180nm
V23 A9 0 1
V24 B9 0 0
M271 Vdd A9 N296 N249 PMOS l=45n w=180n
M272 Vdd A9~ N297 N250 PMOS l=45n w=180n
M273 N296 B9~ P9 N321 PMOS l=45n w=180n
M274 N297 B9 P9 N322 PMOS l=45n w=180n
M275 P9 A9 N484 N438 NMOS l=45n w=90n
M276 N484 B9 0 N511 NMOS l=45n w=90n
M277 P9 A9~ N485 N439 NMOS l=45n w=90n
M278 N485 B9~ 0 N512 NMOS l=45n w=90n
M279 Vdd A9 G9~ N219 PMOS l=45nm w=90nm
M280 Vdd B9 G9~ N220 PMOS l=45nm w=90nm
M281 G9~ A9 N397 N320 NMOS l=45nm w=90nm
M282 N397 B9 0 N418 NMOS l=45nm w=90nm
M283 Vdd A9 A9~ N052 PMOS l=45nm w=180n
M284 A9~ A9 0 N130 NMOS l=45n w=90n
M285 Vdd B9 B9~ N053 PMOS l=45nm w=180n
M286 B9~ B9 0 N131 NMOS l=45n w=90n
M287 Vdd G9~ G9 N225 PMOS l=45nm w=180n
M288 G9 G9~ 0 N348 NMOS l=45n w=90n
M289 Vdd K9 K9~ N054 PMOS l=45nm w=180n
M290 K9~ K9 0 N132 NMOS l=45n w=90n
M291 Vdd P9~ K9 N044 PMOS l=45nm w=90nm
M292 Vdd B9~ K9 N045 PMOS l=45nm w=90nm
M293 K9 P9~ N171 N126 NMOS l=45nm w=90nm
M294 N171 B9 0 N200 NMOS l=45nm w=90nm
M295 Vdd P9 P9~ N304 PMOS l=45nm w=180n
M296 P9~ P9 0 N433 NMOS l=45n w=90n
M§W_100 CO9 P10 CO_6 CO_6 NMOS l=45nm w=90nm
M§W_101 CO_6 K10 0 0 NMOS l=45nm w=180nm
M§W_102 CO_6~ K10~ Vdd N021 PMOS l=45nm w=180nm
M§W_103 CO_6~ G10 0 0 NMOS l=45nm w=180n
M§W_104 CO_6 CLK~ CO_6~ CO_6~ NMOS l=45nm w=360nm
M§W_105 CO_6 CLK~ 0 0 NMOS l=45nm w=270nm
M§W_106 CO_6~ CLK~ 0 0 NMOS l=45nm w=270nm
M§W_107 CO9~ P10 CO_6 CO_6 NMOS l=45nm w=450nm
M§W_108 CO9 P10~ CO_6 CO_6 NMOS l=45nm w=450nm
M§wW_10 CO9~ P10~ CO_6~ CO_6~ NMOS l=45nm w=450nm
M§W_109 CO9 P10 CO_6~ CO_6~ NMOS l=45nm w=450nm
M297 CO9 CLK~ 0 0 NMOS l=45nm w=90nm
M298 CO9~ CLK~ 0 0 NMOS l=45nm w=90nm
M§W_110 CO9~ P10 CO_6~ CO_6~ NMOS l=45nm w=90nm
M299 CO_6 G10~ Vdd N005 PMOS l=45nm w=180nm
V25 A10 0 1
V26 B10 0 0
M300 Vdd A10 N312 N272 PMOS l=45n w=180n
M301 Vdd A10~ N313 N273 PMOS l=45n w=180n
M302 N312 B10~ P10 N350 PMOS l=45n w=180n
M303 N313 B10 P10 N351 PMOS l=45n w=180n
M304 P10 A10 N498 N456 NMOS l=45n w=90n
M305 N498 B10 0 N531 NMOS l=45n w=90n
M306 P10 A10~ N499 N457 NMOS l=45n w=90n
M307 N499 B10~ 0 N532 NMOS l=45n w=90n
M308 Vdd A10 G10~ N232 PMOS l=45nm w=90nm
M309 Vdd B10 G10~ N233 PMOS l=45nm w=90nm
M310 G10~ A10 N411 N349 NMOS l=45nm w=90nm
M311 N411 B10 0 N429 NMOS l=45nm w=90nm
M312 Vdd A10 A10~ N079 PMOS l=45nm w=180n
M313 A10~ A10 0 N149 NMOS l=45n w=90n
M314 Vdd B10 B10~ N080 PMOS l=45nm w=180n
M315 B10~ B10 0 N150 NMOS l=45n w=90n
M316 Vdd G10~ G10 N242 PMOS l=45nm w=180n
M317 G10 G10~ 0 N382 NMOS l=45n w=90n
M318 Vdd K10 K10~ N081 PMOS l=45nm w=180n
M319 K10~ K10 0 N151 NMOS l=45n w=90n
M320 Vdd P10~ K10 N067 PMOS l=45nm w=90nm
M321 Vdd B10~ K10 N068 PMOS l=45nm w=90nm
M322 K10 P10~ N190 N133 NMOS l=45nm w=90nm
M323 N190 B10 0 N208 NMOS l=45nm w=90nm
M324 Vdd P10 P10~ N323 PMOS l=45nm w=180n
M325 P10~ P10 0 N446 NMOS l=45n w=90n
M§W_111 CO_6 P11 CO11 CO11 NMOS l=45nm w=90nm
M§W_112 CO11 K11 0 0 NMOS l=45nm w=180nm
M§W_113 CO11~ K11~ Vdd N022 PMOS l=45nm w=180nm
M§W_114 CO11~ G11 0 0 NMOS l=45nm w=180n
M§W_115 CO11 CLK~ CO11~ CO11~ NMOS l=45nm w=360nm
M§W_116 CO11 CLK~ 0 0 NMOS l=45nm w=270nm
M§W_117 CO11~ CLK~ 0 0 NMOS l=45nm w=270nm
M§W_118 CO_6~ P11 SUM11 SUM11 NMOS l=45nm w=450nm
M§W_119 CO_6 P11~ SUM11 SUM11 NMOS l=45nm w=450nm
M§wW_11 CO_6~ P11~ SUM11~ SUM11~ NMOS l=45nm w=450nm
M§W_120 CO_6 P11 SUM11~ SUM11~ NMOS l=45nm w=450nm
M326 CO_6 CLK~ 0 0 NMOS l=45nm w=90nm
M327 CO_6~ CLK~ 0 0 NMOS l=45nm w=90nm
M§W_121 CO_6~ P11 CO11~ CO11~ NMOS l=45nm w=90nm
M328 CO11 G11~ Vdd N006 PMOS l=45nm w=180nm
V27 A11 0 1
V28 B11 0 0
M329 Vdd A11 N298 N251 PMOS l=45n w=180n
M330 Vdd A11~ N299 N252 PMOS l=45n w=180n
M331 N298 B11~ P11 N325 PMOS l=45n w=180n
M332 N299 B11 P11 N326 PMOS l=45n w=180n
M333 P11 A11 N486 N440 NMOS l=45n w=90n
M334 N486 B11 0 N513 NMOS l=45n w=90n
M335 P11 A11~ N487 N441 NMOS l=45n w=90n
M336 N487 B11~ 0 N514 NMOS l=45n w=90n
M337 Vdd A11 G11~ N221 PMOS l=45nm w=90nm
M338 Vdd B11 G11~ N222 PMOS l=45nm w=90nm
M339 G11~ A11 N398 N324 NMOS l=45nm w=90nm
M340 N398 B11 0 N419 NMOS l=45nm w=90nm
M341 Vdd A11 A11~ N055 PMOS l=45nm w=180n
M342 A11~ A11 0 N134 NMOS l=45n w=90n
M343 Vdd B11 B11~ N056 PMOS l=45nm w=180n
M344 B11~ B11 0 N135 NMOS l=45n w=90n
M345 Vdd G11~ G11 N226 PMOS l=45nm w=180n
M346 G11 G11~ 0 N352 NMOS l=45n w=90n
M347 Vdd K11 K11~ N057 PMOS l=45nm w=180n
M348 K11~ K11 0 N136 NMOS l=45n w=90n
M349 Vdd P11~ K11 N046 PMOS l=45nm w=90nm
M350 Vdd B11~ K11 N047 PMOS l=45nm w=90nm
M351 K11 P11~ N172 N127 NMOS l=45nm w=90nm
M352 N172 B11 0 N201 NMOS l=45nm w=90nm
M353 Vdd P11 P11~ N305 PMOS l=45nm w=180n
M354 P11~ P11 0 N434 NMOS l=45n w=90n
M§W_122 CO11 P12 CO12 CO12 NMOS l=45nm w=90nm
M§W_123 CO12 K12 0 0 NMOS l=45nm w=180nm
M§W_124 CO12~ K12~ Vdd N023 PMOS l=45nm w=180nm
M§W_125 CO12~ G12 0 0 NMOS l=45nm w=180n
M§W_126 CO12 CLK~ CO12~ CO12~ NMOS l=45nm w=360nm
M§W_127 CO12 CLK~ 0 0 NMOS l=45nm w=270nm
M§W_128 CO12~ CLK~ 0 0 NMOS l=45nm w=270nm
M§W_129 CO11~ P12 CO_7 CO_7 NMOS l=45nm w=450nm
M§W_130 CO11 P12~ CO_7 CO_7 NMOS l=45nm w=450nm
M§wW_12 CO11~ P12~ CO_7~ CO_7~ NMOS l=45nm w=450nm
M§W_131 CO11 P12 CO_7~ CO_7~ NMOS l=45nm w=450nm
M355 CO11 CLK~ 0 0 NMOS l=45nm w=90nm
M356 CO11~ CLK~ 0 0 NMOS l=45nm w=90nm
M§W_132 CO11~ P12 CO12~ CO12~ NMOS l=45nm w=90nm
M357 CO12 G12~ Vdd N007 PMOS l=45nm w=180nm
V29 A12 0 1
V30 B12 0 0
M358 Vdd A12 N314 N274 PMOS l=45n w=180n
M359 Vdd A12~ N315 N275 PMOS l=45n w=180n
M360 N314 B12~ P12 N354 PMOS l=45n w=180n
M361 N315 B12 P12 N355 PMOS l=45n w=180n
M362 P12 A12 N500 N458 NMOS l=45n w=90n
M363 N500 B12 N549 N533 NMOS l=45n w=90n
M364 P12 A12~ N501 N459 NMOS l=45n w=90n
M365 N501 B12~ N549 N534 NMOS l=45n w=90n
M366 Vdd A12 G12~ N234 PMOS l=45nm w=90nm
M367 Vdd B12 G12~ N235 PMOS l=45nm w=90nm
M368 G12~ A12 N412 N353 NMOS l=45nm w=90nm
M369 N412 B12 0 N430 NMOS l=45nm w=90nm
M370 Vdd A12 A12~ N082 PMOS l=45nm w=180n
M371 A12~ A12 0 N152 NMOS l=45n w=90n
M372 Vdd B12 B12~ N083 PMOS l=45nm w=180n
M373 B12~ B12 0 N153 NMOS l=45n w=90n
M374 Vdd G12~ G12 N243 PMOS l=45nm w=180n
M375 G12 G12~ 0 N383 NMOS l=45n w=90n
M376 Vdd K12 K12~ N084 PMOS l=45nm w=180n
M377 K12~ K12 0 N154 NMOS l=45n w=90n
M378 Vdd P12~ K12 N069 PMOS l=45nm w=90nm
M379 Vdd B12~ K12 N070 PMOS l=45nm w=90nm
M380 K12 P12~ N191 K12 NMOS l=45nm w=90nm
M381 N191 B12 0 0 NMOS l=45nm w=90nm
M382 Vdd P12 P12~ N327 PMOS l=45nm w=180n
M383 P12~ P12 0 N447 NMOS l=45n w=90n
M§W_133 CO12 P13 CO13 CO13 NMOS l=45nm w=90nm
M§W_134 CO13 K13 0 0 NMOS l=45nm w=180nm
M§W_135 CO13~ K13~ Vdd N024 PMOS l=45nm w=180nm
M§W_136 CO13~ G13 0 0 NMOS l=45nm w=180n
M§W_137 CO13 CLK~ CO13~ CO13~ NMOS l=45nm w=360nm
M§W_138 CO13 CLK~ 0 0 NMOS l=45nm w=270nm
M§W_139 CO13~ CLK~ 0 0 NMOS l=45nm w=270nm
M§W_140 CO12~ P13 CO_8 CO_8 NMOS l=45nm w=450nm
M§W_141 CO12 P13~ CO_8 CO_8 NMOS l=45nm w=450nm
M§wW_13 CO12~ P13~ CO_8~ CO_8~ NMOS l=45nm w=450nm
M§W_142 CO12 P13 CO_8~ CO_8~ NMOS l=45nm w=450nm
M384 CO12 CLK~ 0 0 NMOS l=45nm w=90nm
M385 CO12~ CLK~ 0 0 NMOS l=45nm w=90nm
M§W_143 CO12~ P13 CO13~ CO13~ NMOS l=45nm w=90nm
M386 CO13 G13~ Vdd N008 PMOS l=45nm w=180nm
M§W_144 CO13 P14 CO14 CO14 NMOS l=45nm w=90nm
M§W_145 CO14 K14 0 0 NMOS l=45nm w=180nm
M§W_146 CO14~ K14~ Vdd N018 PMOS l=45nm w=180nm
M§W_147 CO14~ G14 0 0 NMOS l=45nm w=180n
M§W_148 CO14 CLK~ CO14~ CO14~ NMOS l=45nm w=360nm
M§W_149 CO14 CLK~ 0 0 NMOS l=45nm w=270nm
M§W_150 CO14~ CLK~ 0 0 NMOS l=45nm w=270nm
M§W_151 CO13~ P14 CO_9 CO_9 NMOS l=45nm w=450nm
M§W_152 CO13 P14~ CO_9 CO_9 NMOS l=45nm w=450nm
M§wW_14 CO13~ P14~ CO_9~ CO_9~ NMOS l=45nm w=450nm
M§W_153 CO13 P14 CO_9~ CO_9~ NMOS l=45nm w=450nm
M387 CO13 CLK~ 0 0 NMOS l=45nm w=90nm
M388 CO13~ CLK~ 0 0 NMOS l=45nm w=90nm
M§W_154 CO13~ P14 CO14~ CO14~ NMOS l=45nm w=90nm
M389 CO14 G14~ Vdd N002 PMOS l=45nm w=180nm
M§W_155 CO14 P15 CO15 CO15 NMOS l=45nm w=90nm
M§W_156 CO15 K15 0 0 NMOS l=45nm w=180nm
M§W_157 CO15~ K15~ Vdd N019 PMOS l=45nm w=180nm
M§W_158 CO15~ G15 0 0 NMOS l=45nm w=180n
M§W_159 CO15 CLK~ CO15~ CO15~ NMOS l=45nm w=360nm
M§W_160 CO15 CLK~ 0 0 NMOS l=45nm w=270nm
M§W_161 CO15~ CLK~ 0 0 NMOS l=45nm w=270nm
M§W_162 CO14~ P15 SUM15 SUM15 NMOS l=45nm w=450nm
M§W_163 CO14 P15~ SUM15 SUM15 NMOS l=45nm w=450nm
M§wW_15 CO14~ P15~ SUM15~ SUM15~ NMOS l=45nm w=450nm
M§W_164 CO14 P15 SUM15~ SUM15~ NMOS l=45nm w=450nm
M390 CO14 CLK~ 0 0 NMOS l=45nm w=90nm
M391 CO14~ CLK~ 0 0 NMOS l=45nm w=90nm
M§W_165 CO14~ P15 CO15~ CO15~ NMOS l=45nm w=90nm
M392 CO15 G15~ Vdd N003 PMOS l=45nm w=180nm
V31 A13 0 1
V32 B13 0 0
M393 Vdd A13 N316 N276 PMOS l=45n w=180n
M394 Vdd A13~ N317 N277 PMOS l=45n w=180n
M395 N316 B13~ P13 N357 PMOS l=45n w=180n
M396 N317 B13 P13 N358 PMOS l=45n w=180n
M397 P13 A13 N502 N460 NMOS l=45n w=90n
M398 N502 B13 0 N535 NMOS l=45n w=90n
M399 P13 A13~ N503 N461 NMOS l=45n w=90n
M400 N503 B13~ 0 N536 NMOS l=45n w=90n
M401 Vdd A13 G13~ N236 PMOS l=45nm w=90nm
M402 Vdd B13 G13~ N237 PMOS l=45nm w=90nm
M403 G13~ A13 N413 N356 NMOS l=45nm w=90nm
M404 N413 B13 0 N431 NMOS l=45nm w=90nm
M405 Vdd A13 A13~ N085 PMOS l=45nm w=180n
M406 A13~ A13 0 N155 NMOS l=45n w=90n
M407 Vdd B13 B13~ N086 PMOS l=45nm w=180n
M408 B13~ B13 0 N156 NMOS l=45n w=90n
M409 Vdd G13~ G13 N244 PMOS l=45nm w=180n
M410 G13 G13~ 0 N384 NMOS l=45n w=90n
M411 Vdd K13 K13~ N087 PMOS l=45nm w=180n
M412 K13~ K13 0 N157 NMOS l=45n w=90n
M413 Vdd P13~ K13 N071 PMOS l=45nm w=90nm
M414 Vdd B13~ K13 N072 PMOS l=45nm w=90nm
M415 K13 P13~ N192 K13 NMOS l=45nm w=90nm
M416 N192 B13 0 0 NMOS l=45nm w=90nm
M417 Vdd P13 P13~ N328 PMOS l=45nm w=180n
M418 P13~ P13 0 N448 NMOS l=45n w=90n
V33 A14 0 1
V34 B14 0 0
M419 Vdd A14 N306 N261 PMOS l=45n w=180n
M420 Vdd A14~ N307 N262 PMOS l=45n w=180n
M421 N306 B14~ P14 N339 PMOS l=45n w=180n
M422 N307 B14 P14 N340 PMOS l=45n w=180n
M423 P14 A14 N494 N449 NMOS l=45n w=90n
M424 N494 B14 0 N523 NMOS l=45n w=90n
M425 P14 A14~ N495 N450 NMOS l=45n w=90n
M426 N495 B14~ 0 N524 NMOS l=45n w=90n
M427 Vdd A14 G14~ N227 PMOS l=45nm w=90nm
M428 Vdd B14 G14~ N228 PMOS l=45nm w=90nm
M429 G14~ A14 N406 N338 NMOS l=45nm w=90nm
M430 N406 B14 0 N424 NMOS l=45nm w=90nm
M431 Vdd A14 A14~ N073 PMOS l=45nm w=180n
M432 A14~ A14 0 N142 NMOS l=45n w=90n
M433 Vdd B14 B14~ N074 PMOS l=45nm w=180n
M434 B14~ B14 0 N143 NMOS l=45n w=90n
M435 Vdd G14~ G14 N238 PMOS l=45nm w=180n
M436 G14 G14~ 0 N367 NMOS l=45n w=90n
M437 Vdd K14 K14~ N075 PMOS l=45nm w=180n
M438 K14~ K14 0 N144 NMOS l=45n w=90n
M439 Vdd P14~ K14 N058 PMOS l=45nm w=90nm
M440 Vdd B14~ K14 N059 PMOS l=45nm w=90nm
M441 K14 P14~ N180 K14 NMOS l=45nm w=90nm
M442 N180 B14 0 0 NMOS l=45nm w=90nm
M443 Vdd P14 P14~ N318 PMOS l=45nm w=180n
M444 P14~ P14 0 N442 NMOS l=45n w=90n
V35 A15 0 1
V36 B15 0 0
M445 Vdd A15 N308 N263 PMOS l=45n w=180n
M446 Vdd A15~ N309 N264 PMOS l=45n w=180n
M447 N308 B15~ P15 N342 PMOS l=45n w=180n
M448 N309 B15 P15 N343 PMOS l=45n w=180n
M449 P15 A15 N496 N451 NMOS l=45n w=90n
M450 N496 B15 0 N525 NMOS l=45n w=90n
M451 P15 A15~ N497 N452 NMOS l=45n w=90n
M452 N497 B15~ 0 N526 NMOS l=45n w=90n
M453 Vdd A15 G15~ N229 PMOS l=45nm w=90nm
M454 Vdd B15 G15~ N230 PMOS l=45nm w=90nm
M455 G15~ A15 N407 N341 NMOS l=45nm w=90nm
M456 N407 B15 0 N425 NMOS l=45nm w=90nm
M457 Vdd A15 A15~ N076 PMOS l=45nm w=180n
M458 A15~ A15 0 N145 NMOS l=45n w=90n
M459 Vdd B15 B15~ N077 PMOS l=45nm w=180n
M460 B15~ B15 0 N146 NMOS l=45n w=90n
M461 Vdd G15~ G15 N239 PMOS l=45nm w=180n
M462 G15 G15~ 0 N368 NMOS l=45n w=90n
M463 Vdd K15 K15~ N078 PMOS l=45nm w=180n
M464 K15~ K15 0 N147 NMOS l=45n w=90n
M465 Vdd P15~ K15 N060 PMOS l=45nm w=90nm
M466 Vdd B15~ K15 N061 PMOS l=45nm w=90nm
M467 K15 P15~ N181 K15 NMOS l=45nm w=90nm
M468 N181 B15 0 0 NMOS l=45nm w=90nm
M469 Vdd P15 P15~ N319 PMOS l=45nm w=180n
M470 P15~ P15 0 N443 NMOS l=45n w=90n
M471 Vdd CLK N035 Vdd PMOS l=45nm w=180nm
M§WP1 Vdd N035 N039 Vdd PMOS l=45nm w=1350nm
M§WP2 Vdd CLK N040 Vdd PMOS l=45nm w=1350nm
M§WP3 Vdd N038 N039 Vdd PMOS l=45nm w=270nm
M§WP4 N037 CLK Vdd Vdd PMOS l=45nm w=1350nm
M§WP5 N037 SUM15 N041 N037 PMOS l=45nm w=270nm
M§WP6 N037 SUM15~ N042 N037 PMOS l=45nm w=270nm
M§WP7 Vdd N039 N040 Vdd PMOS l=45nm w=270nm
M472 Vdd N039 SUM_OUT+ Vdd PMOS l=45nm w=180nm
M473 Vdd N038 SUM_OUT- Vdd PMOS l=45nm w=180nm
M474 N035 CLK 0 0 NMOS l=45nm w=90nm
M475 SUM_OUT- N038 0 0 NMOS l=45nm w=90nm
M476 SUM_OUT+ N039 0 0 NMOS l=45nm w=90nm
M§WN1 0 CLK N041 0 NMOS l=45nm w=90nm
M§WN2 N041 N042 0 0 NMOS l=45nm w=270nm
M§WN3 N042 N041 0 0 NMOS l=45nm w=270nm
M§WN4 N039 N042 0 0 NMOS l=45nm w=270nm
M§WN5 N040 N041 0 0 NMOS l=45nm w=270nm
M§WN6 0 CLK N042 0 NMOS l=45nm w=90nm
M477 Vdd CLK N125 Vdd PMOS l=45nm w=180nm
M§WP8 Vdd N125 N175 Vdd PMOS l=45nm w=1350nm
M§WP9 Vdd CLK N198 Vdd PMOS l=45nm w=1350nm
M§WP10 Vdd N174 N175 Vdd PMOS l=45nm w=270nm
M§WP11 N173 CLK Vdd Vdd PMOS l=45nm w=1350nm
M§WP12 N173 CO15 N217 N173 PMOS l=45nm w=270nm
M§WP13 N173 CO15~ N218 N173 PMOS l=45nm w=270nm
M§WP14 Vdd N175 N198 Vdd PMOS l=45nm w=270nm
M478 Vdd N175 CARRY_OUT+ Vdd PMOS l=45nm w=180nm
M479 Vdd N174 CARRY_OUT- Vdd PMOS l=45nm w=180nm
M480 N125 CLK 0 0 NMOS l=45nm w=90nm
M481 CARRY_OUT- N174 0 0 NMOS l=45nm w=90nm
M482 CARRY_OUT+ N175 0 0 NMOS l=45nm w=90nm
M§WN7 0 CLK N217 0 NMOS l=45nm w=90nm
M§WN8 N217 N218 0 0 NMOS l=45nm w=270nm
M§WN9 N218 N217 0 0 NMOS l=45nm w=270nm
M§WN10 N175 N218 0 0 NMOS l=45nm w=270nm
M§WN11 N198 N217 0 0 NMOS l=45nm w=270nm
M§WN12 0 CLK N218 0 NMOS l=45nm w=90nm
M483 Cin GP CO NC_05 NMOS
M484 Cin~ GP CO~ NC_06 NMOS
M485 CO0 GP CO_1 NC_07 NMOS
M486 CO0~ GP CO_2~ NC_08 NMOS
M487 CO GP CO_3 NC_09 NMOS
M488 CO~ GP CO_2~ NC_10 NMOS
M489 CO_1 GP CO_3 NC_11 NMOS
M490 CO_2~ GP CO_3~ NC_12 NMOS
M491 CO_3 GP CO_4 NC_13 NMOS
M492 CO_3~ GP CO_4~ NC_14 NMOS
M493 CO_3 GP CO_6 NC_15 NMOS
M494 CO_2~ GP CO_6~ NC_16 NMOS
M495 CO_4 GP CO_6 NC_17 NMOS
M496 CO_4~ GP CO_6~ NC_18 NMOS
M497 CO_6 GP CO_7 NC_19 NMOS
M498 CO_6~ GP CO_7~ NC_20 NMOS
M499 CO_6 GP CO_8 NC_21 NMOS
M500 CO_6~ GP CO_8~ NC_22 NMOS
M501 CO_6 GP CO_9 NC_23 NMOS
M502 CO_6~ GP CO_9~ NC_24 NMOS
.model NMOS NMOS
.model PMOS PMOS
.lib standard.mos
.TRAN 400p 800p 50p
.inc /Users/ajiteshkumarsingh/Documents/Semester 5/DCMOS/VLS 503 Model Files/ptm_45nm_hp.l
* Stage 2
* Stage 1
* Stage 0
* Stage 4
* Stage 5
* Stage 6
* Stage 7
* Stage 9
* Stage 10
* Stage 8
* Stage 11
* Stage 12
* Stage 13
* Stage 14
* Stage 15
* Stage 3
.backanno
.end